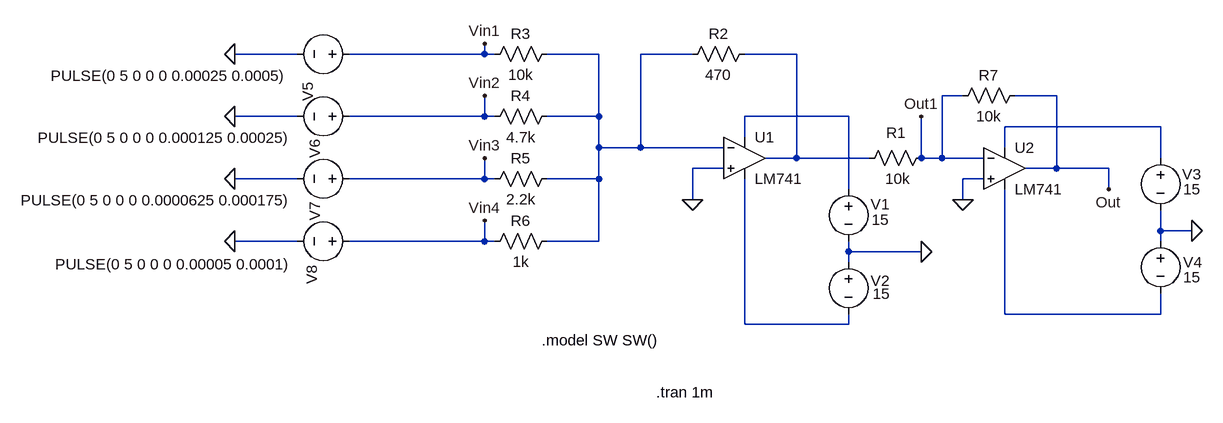
[diagram p0: schematic LM741summing.asc]
LM741summing.asc, the LTspice schematic file:
Version 4
SHEET 1 900 680
WIRE -496 -16 -592 -16
WIRE -208 -16 -208 -32
WIRE -208 -16 -416 -16
WIRE -192 -16 -208 -16
WIRE -32 -16 -112 -16
WIRE 112 -16 32 -16
WIRE 272 -16 192 -16
WIRE 528 48 496 48
WIRE 672 48 608 48
WIRE -496 80 -592 80
WIRE -208 80 -208 48
WIRE -208 80 -416 80
WIRE -192 80 -208 80
WIRE -32 80 -32 -16
WIRE -32 80 -112 80
WIRE 352 80 192 80
WIRE 832 96 592 96
WIRE 192 112 192 80
WIRE -32 128 -32 80
WIRE 32 128 32 -16
WIRE 32 128 -32 128
WIRE 160 128 32 128
WIRE 592 128 592 96
WIRE 272 144 272 -16
WIRE 272 144 224 144
WIRE 384 144 272 144
WIRE 464 144 464 80
WIRE 496 144 496 48
WIRE 496 144 464 144
WIRE 560 144 496 144
WIRE 832 144 832 96
WIRE 160 160 112 160
WIRE 672 160 672 48
WIRE 672 160 624 160
WIRE 752 160 672 160
WIRE -496 176 -592 176
WIRE -208 176 -208 144
WIRE -208 176 -416 176
WIRE -192 176 -208 176
WIRE -32 176 -32 128
WIRE -32 176 -112 176
WIRE 560 176 528 176
WIRE 352 192 352 80
WIRE 752 192 752 160
WIRE 112 208 112 160
WIRE 528 208 528 176
WIRE 832 256 832 224
WIRE 880 256 832 256
WIRE -496 272 -592 272
WIRE -208 272 -208 240
WIRE -208 272 -416 272
WIRE -192 272 -208 272
WIRE -32 272 -32 176
WIRE -32 272 -112 272
WIRE 832 272 832 256
WIRE 352 288 352 272
WIRE 464 288 352 288
WIRE 352 304 352 288
WIRE 592 384 592 192
WIRE 832 384 832 352
WIRE 832 384 592 384
WIRE 192 400 192 176
WIRE 352 400 352 384
WIRE 352 400 192 400
FLAG 112 208 0
FLAG 464 288 0
FLAG 528 208 0
FLAG 880 256 0
FLAG 752 192 Out
FLAG 464 80 Out1
FLAG -208 -32 Vin1
FLAG -208 48 Vin2
FLAG -208 144 Vin3
FLAG -208 240 Vin4
FLAG -592 -16 0
FLAG -592 80 0
FLAG -592 176 0
FLAG -592 272 0
SYMBOL LM741 192 80 R0
SYMATTR InstName U1
SYMBOL voltage 352 176 R0
WINDOW 0 34 39 Left 2
WINDOW 3 36 63 Left 2
WINDOW 123 0 0 Left 0
WINDOW 39 0 0 Left 0
SYMATTR InstName V1
SYMATTR Value 15
SYMBOL voltage 352 288 R0
WINDOW 0 34 45 Left 2
WINDOW 3 37 65 Left 2
WINDOW 123 0 0 Left 0
WINDOW 39 0 0 Left 0
SYMATTR InstName V2
SYMATTR Value 15
SYMBOL res 480 128 R90
WINDOW 0 -7 55 VBottom 2
WINDOW 3 32 52 VTop 2
SYMATTR InstName R1
SYMATTR Value 10k
SYMBOL res 208 -32 R90
WINDOW 0 0 56 VBottom 2
WINDOW 3 32 56 VTop 2
SYMATTR InstName R2
SYMATTR Value 470
SYMBOL res -96 -32 R90
WINDOW 0 0 56 VBottom 2
WINDOW 3 32 56 VTop 2
SYMATTR InstName R3
SYMATTR Value 10k
SYMBOL res -96 64 R90
WINDOW 0 0 56 VBottom 2
WINDOW 3 32 56 VTop 2
SYMATTR InstName R4
SYMATTR Value 4.7k
SYMBOL res -96 160 R90
WINDOW 0 0 56 VBottom 2
WINDOW 3 32 56 VTop 2
SYMATTR InstName R5
SYMATTR Value 2.2k
SYMBOL res -96 256 R90
WINDOW 0 0 56 VBottom 2
WINDOW 3 32 56 VTop 2
SYMATTR InstName R6
SYMATTR Value 1k
SYMBOL LM741 592 96 R0
SYMATTR InstName U2
SYMBOL res 624 32 R90
WINDOW 0 0 56 VBottom 2
WINDOW 3 32 56 VTop 2
SYMATTR InstName R7
SYMATTR Value 10k
SYMBOL voltage 832 128 R0
WINDOW 0 33 41 Left 2
WINDOW 3 35 64 Left 2
WINDOW 123 0 0 Left 0
WINDOW 39 0 0 Left 0
SYMATTR InstName V3
SYMATTR Value 15
SYMBOL voltage 832 256 R0
WINDOW 0 35 48 Left 2
WINDOW 3 35 71 Left 2
WINDOW 123 0 0 Left 0
WINDOW 39 0 0 Left 0
SYMATTR InstName V4
SYMATTR Value 15
SYMBOL voltage -400 -16 R90
WINDOW 0 43 80 Left 2
WINDOW 3 33 111 VRight 2
WINDOW 123 0 0 Left 0
WINDOW 39 0 0 Left 0
SYMATTR InstName V5
SYMATTR Value PULSE(0 5 0 0 0 0.00025 0.0005)
SYMBOL voltage -400 80 R90
WINDOW 0 35 69 Left 2
WINDOW 3 33 104 VRight 2
WINDOW 123 0 0 Left 0
WINDOW 39 0 0 Left 0
SYMATTR InstName V6
SYMATTR Value PULSE(0 5 0 0 0 0.000125 0.00025)
SYMBOL voltage -400 176 R90
WINDOW 0 35 69 Left 2
WINDOW 3 33 103 VRight 2
WINDOW 123 0 0 Left 0
WINDOW 39 0 0 Left 0
SYMATTR InstName V7
SYMATTR Value PULSE(0 5 0 0 0 0.0000625 0.000175)
SYMBOL voltage -400 272 R90
WINDOW 0 37 74 Left 2
WINDOW 3 35 104 VRight 2
WINDOW 123 0 0 Left 0
WINDOW 39 0 0 Left 0
SYMATTR InstName V8
SYMATTR Value PULSE(0 5 0 0 0 0.00005 0.0001)
TEXT -120 424 Left 2 !.model SW SW()
TEXT 56 504 Left 2 !.tran 1m

The netlist it stands for:
* LM741summing.asc
XU1 0 N001 N003 N006 N002 LM741  ; pins In+ In- V+ V- OUT
V1 N003 0 15
V2 0 N006 15
R1 Out1 N002 10k
R2 N002 N001 470
R3 N001 Vin1 10k
R4 N001 Vin2 4.7k
R5 N001 Vin3 2.2k
R6 N001 Vin4 1k
XU2 0 Out1 N004 N005 Out LM741  ; pins In+ In- V+ V- OUT
R7 Out Out1 10k
V3 N004 0 15
V4 0 N005 15
V5 Vin1 0 PULSE(0 5 0 0 0 0.00025 0.0005)
V6 Vin2 0 PULSE(0 5 0 0 0 0.000125 0.00025)
V7 Vin3 0 PULSE(0 5 0 0 0 0.0000625 0.000175)
V8 Vin4 0 PULSE(0 5 0 0 0 0.00005 0.0001)
.model SW SW()
.tran 1m
.lib LM741.lib
.backanno
.end